# Altium schematic sheet BoardB-USB.SchDoc
size A; SheetNumber: 6; SheetTotal: 9
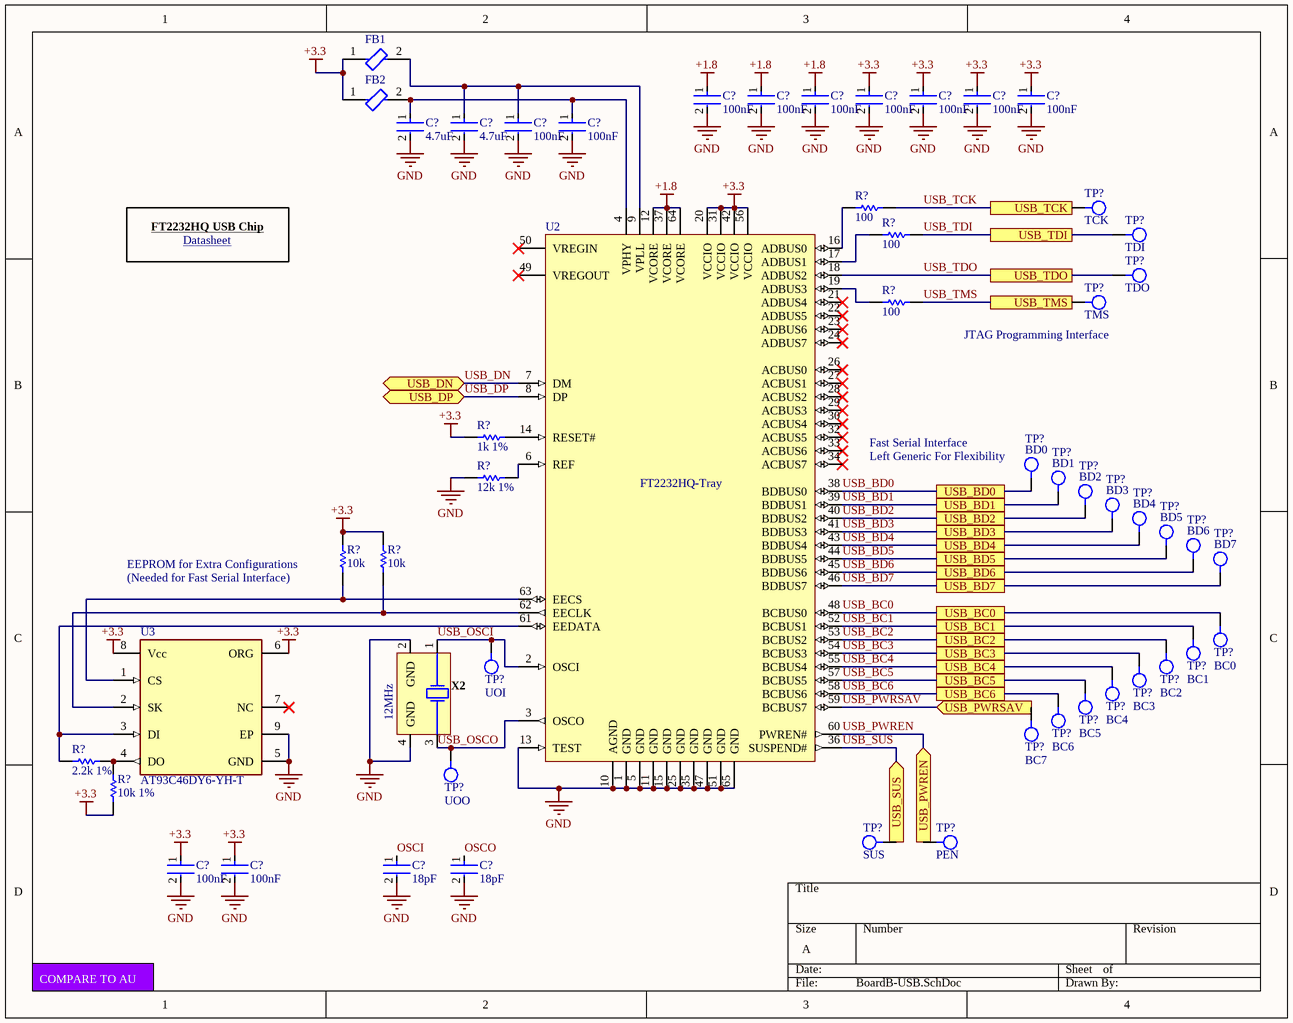
[diagram p0: BoardB-USB.SchDoc]

## Parts
(Parts that share a designator on the sheet are numbered #1, #2 ... from top to bottom, then left to right.)
C?#1  100nF  [FP-C0402-BB-MFG]
C?#2  100nF  [FP-C0402-BB-MFG]
C?#3  100nF  [FP-C0402-BB-MFG]
C?#4  100nF  [FP-C0402-BB-MFG]
C?#5  100nF  [FP-C0402-BB-MFG]
C?#6  100nF  [FP-C0402-BB-MFG]
C?#7  100nF  [FP-C0402-BB-MFG]
C?#8  4.7uF  [FP-GRM155-0_1-IPC_B]
C?#9  4.7uF  [FP-GRM155-0_1-IPC_B]
C?#10  100nF  [FP-C0402-BB-MFG]
C?#11  100nF  [FP-C0402-BB-MFG]
C?#12  100nF  [FP-C0402-BB-MFG]
C?#13  100nF  [FP-C0402-BB-MFG]
C?#14  18pF  [FP-C0402-BB-MFG]
C?#15  18pF  [FP-C0402-BB-MFG]
FB1  MI0603J601R-10  [FP-MI0603-MFG]  (value not drawn)
FB2  MI0603J601R-10  [FP-MI0603-MFG]  (value not drawn)
R?#1  100  [RESC1005X40X25ML05T10]
R?#2  100  [RESC1005X40X25ML05T10]
R?#3  100  [RESC1005X40X25ML05T10]
R?#4  1k 1%  [RESC1005X40X25NL05T10]
R?#5  12k 1%  [RESC1005X40X25ML05T05]
R?#6  10k  [RESC1005X40X25LL05T05]
R?#7  10k  [RESC1005X40X25LL05T05]
R?#8  2.2k 1%  [RESC1005X40X25NL05T10]
R?#9  10k 1%  [RESC1005X40X25LL05T05]
TP?#1  TCK
TP?#2  TDI
TP?#3  TDO
TP?#4  TMS
TP?#5  BD0
TP?#6  BD1
TP?#7  BD2
TP?#8  BD3
TP?#9  BD4
TP?#10  BD5
TP?#11  BD6
TP?#12  BD7
TP?#13  BC0
TP?#14  BC1
TP?#15  UOI
TP?#16  BC2
TP?#17  BC3
TP?#18  BC4
TP?#19  BC5
TP?#20  BC6
TP?#21  BC7
TP?#22  UOO
TP?#23  SUS
TP?#24  PEN
U2  FT2232HQ-Tray  [QFN64_2_N]
U3  AT93C46DY6-YH-T  [FP-C04-21355-Q4B-IPC_C]
X2  ABM8G-12.000MHZ-4Y-T3  [ABM8G-12.000MHZ-4Y-T3]  (value not drawn)

## Ports
USB_BC0, USB_BC1, USB_BC2, USB_BC3, USB_BC4, USB_BC5, USB_BC6, USB_BD0, USB_BD1, USB_BD2, USB_BD3, USB_BD4, USB_BD5, USB_BD6, USB_BD7, USB_DN (bidir), USB_DP (bidir), USB_PWREN (in), USB_PWRSAV (in), USB_SUS (in), USB_TCK, USB_TDI, USB_TDO, USB_TMS

## Nets
+1.8: C?#1.1 C?#2.1 C?#3.1 U2.12(VCORE) U2.37(VCORE) U2.64(VCORE)
+3.3: C?#4.1 C?#5.1 C?#6.1 C?#7.1 C?#12.1 C?#13.1 FB1.1 FB2.1 R?#4.1 R?#6.2 R?#7.2 R?#9.1 U2.20(VCCIO) U2.31(VCCIO) U2.42(VCCIO) U2.56(VCCIO) U3.6(ORG) U3.8(Vcc)
GND: C?#1.2 C?#2.2 C?#3.2 C?#4.2 C?#5.2 C?#6.2 C?#7.2 C?#8.2 C?#9.2 C?#10.2 C?#11.2 C?#12.2 C?#13.2 C?#14.2 C?#15.2 R?#5.1 U2.1(GND) U2.5(GND) U2.10(AGND) U2.11(GND) U2.13(TEST) U2.15(GND) U2.25(GND) U2.35(GND) U2.47(GND) U2.51(GND) U2.65(GND) U3.5(GND) U3.9(EP) X2.2(GND) X2.4(GND)
OSCI: C?#14.1
OSCO: C?#15.1
USB_BC0: TP?#13.1 U2.48(BCBUS0) ; port USB_BC0
USB_BC1: TP?#14.1 U2.52(BCBUS1) ; port USB_BC1
USB_BC2: TP?#16.1 U2.53(BCBUS2) ; port USB_BC2
USB_BC3: TP?#17.1 U2.54(BCBUS3) ; port USB_BC3
USB_BC4: TP?#18.1 U2.55(BCBUS4) ; port USB_BC4
USB_BC5: TP?#19.1 U2.57(BCBUS5) ; port USB_BC5
USB_BC6: TP?#20.1 U2.58(BCBUS6) ; port USB_BC6
USB_BD0: TP?#5.1 U2.38(BDBUS0) ; port USB_BD0
USB_BD1: TP?#6.1 U2.39(BDBUS1) ; port USB_BD1
USB_BD2: TP?#7.1 U2.40(BDBUS2) ; port USB_BD2
USB_BD3: TP?#8.1 U2.41(BDBUS3) ; port USB_BD3
USB_BD4: TP?#9.1 U2.43(BDBUS4) ; port USB_BD4
USB_BD5: TP?#10.1 U2.44(BDBUS5) ; port USB_BD5
USB_BD6: TP?#11.1 U2.45(BDBUS6) ; port USB_BD6
USB_BD7: TP?#12.1 U2.46(BDBUS7) ; port USB_BD7
USB_DN: U2.7(DM) ; port USB_DN
USB_DP: U2.8(DP) ; port USB_DP
USB_OSCI: TP?#15.1 U2.2(OSCI) X2.1
USB_OSCO: TP?#22.1 U2.3(OSCO) X2.3
USB_PWREN: TP?#24.1 U2.60(PWREN#) ; port USB_PWREN
USB_PWRSAV: TP?#21.1 U2.59(BCBUS7) ; port USB_PWRSAV
USB_SUS: TP?#23.1 U2.36(SUSPEND#) ; port USB_SUS
USB_TCK: R?#1.2 TP?#1.1 ; port USB_TCK
USB_TDI: R?#2.2 TP?#2.1 ; port USB_TDI
USB_TDO: TP?#3.1 U2.18(ADBUS2) ; port USB_TDO
USB_TMS: R?#3.2 TP?#4.1 ; port USB_TMS
NetC?#8_1: C?#8.1 C?#11.1 FB2.2 U2.4(VPHY)
NetC?#9_1: C?#9.1 C?#10.1 FB1.2 U2.9(VPLL)
NetR?#1_1: R?#1.1 U2.16(ADBUS0)
NetR?#2_1: R?#2.1 U2.17(ADBUS1)
NetR?#3_1: R?#3.1 U2.19(ADBUS3)
NetR?#4_2: R?#4.2 U2.14(RESET#)
NetR?#5_2: R?#5.2 U2.6(REF)
NetR?#6_1: R?#6.1 U2.63(EECS) U3.1(CS)
NetR?#7_1: R?#7.1 U2.62(EECLK) U3.2(SK)
NetR?#8_1: R?#8.1 U2.61(EEDATA) U3.3(DI)
NetR?#8_2: R?#8.2 R?#9.2 U3.4(DO)

Not connected (* = marked no-connect by the designer): U2 21(ADBUS4)* 22(ADBUS5)* 23(ADBUS6)* 24(ADBUS7)* 26(ACBUS0)* 27(ACBUS1)* 28(ACBUS2)* 29(ACBUS3)* 30(ACBUS4)* 32(ACBUS5)* 33(ACBUS6)* 34(ACBUS7)* 49(VREGOUT)* 50(VREGIN)*; U3 7(NC)*

## Notes on the sheet
- FT2232HQ USB Chip
- Datasheet <https://www.ftdichip.com/Support/Documents/DataSheets/ICs/DS_FT2232H.pdf>
- (near TP?#4) JTAG Programming Interface
- Fast Serial Interface
- (near TP?#5) Left Generic For Flexibility
- (near R?#6) EEPROM for Extra Configurations
- (near R?#6) (Needed for Fast Serial Interface)
- (near X2) 12MHz
- COMPARE TO AU

## Library data of the parts
C?#1-C?#7 C?#10-C?#13 = CMP-2008-02046-2: CAP CER 0.1UF 10V X5R 0402; Manufacturer: Kemet; Manufacturer Part Number: C0402C104K8PACTU; Material: Ceramic; Capacitance: 0.10 μF; Temperature Coefficient: 15%; Tolerance: 0.1; Value: 0.10 μF; Package: C0402-BB; Temperature: -55°C to +125°C; ComponentLink2Description: Datasheet; Temperature Characteristic: X5R; Device Class L1: Passive Components; Height: 0.55mm; Lead Free: Yes; ComponentLink2URL: https://content.kemet.com/datasheets/KEM_C1002_X7R_SMD.pdf; Device Class L2: Capacitors; Temperature Range Low: -55°C; Temperature Range High: +125°C; RoHS: TRUE; Octopart: https://octopart.com/c0402c104k8pactu-kemet-140039; Automotive: No; Mouser Description: Capacitor 100 nF 10 VDC 0402; Category: Cap; Voltage Rating: 10 V; Digikey Description: CAP CER 0.1UF 10V X5R 0402; Ipc Land Pattern Name: CAPC10050X50; Device Class L3: Ceramic Capacitors
C?#8 C?#9 = CMP-2008-04549-2: Chip Multilayer Ceramic Capacitors for General Purpose, 0402, 4.7uF, X5R, 15%, 20%, 6.3V; Height: 0.5mm; Weight: 0.000212oz; Length: 1mm; Case Code (Metric): 1005; Packaging: Tape and Reel; Termination: SMD/SMT; Dielectric: X5R; Depth: 0.5mm; Case Code (Imperial): 0402; Min Operating Temperature: -55°C; Case/Package: 0402; Voltage: 6.3V; Width: 0.02inch; Capacitance: 4.7uF; Lead Free: Lead Free; Thickness: 0.022inch; Contact Plating: Tin; REACH SVHC: No SVHC; Package Quantity: 10000; Tolerance: 20%; Voltage Rating (DC): 6.3V; Voltage Rating: 6.3V; Mount: Surface Mount; Max Operating Temperature: 85°C
C?#14 C?#15 = CMP-2008-03288-2: CAP CER 18PF 50V 5% NP0 0402; Manufacturer Part Number: C0402C180J5GACTU; Manufacturer: Kemet; Temperature Coefficient: 15%; Temperature Characteristic: C0G; Tolerance: 0.05; Material: Ceramic; Ipc Land Pattern Name: CAPC10050X50; Capacitance: 18 pF; Category: Cap; RoHS: TRUE; Automotive: No; Temperature Range High: +125°C; Height: 0.55mm; ComponentLink2Description: Datasheet; Lead Free: Yes; Value: 18 pF; Device Class L3: Ceramic Capacitors; Device Class L1: Passive Components; Digikey Description: CAP CER 18PF 50V 5% NP0 0402; Device Class L2: Capacitors; Voltage Rating: 50 V; ComponentLink2URL: https://content.kemet.com/datasheets/KEM_C1002_X7R_SMD.pdf; Octopart: https://octopart.com/c0402c180j5gactu-kemet-9138803; Mouser Description: Multilayer Ceramic Capacitors MLCC - SMD/SMT 50volts 18pF C0G 5%; Temperature: -55°C to +125°C; Temperature Range Low: -55°C; Package: C0402-BB
FB1 FB2 = CMP-2000-06700-2: FERRITE BEAD 600 OHM 0603 1LN; Manufacturer: Laird; Rms Current: 1000mA; Series Resistance: 0.2Ω; Impedance At Frequency: 600Ω @ 100MHz; Package: MI0603; Device Class L2: EMI / RFI Components; Ipc Land Pattern Name: CAPC16080X80; Category: FBead; Digikey Description: FERRITE BEAD 600 OHM 0603 1LN; Temperature Range High: +125°C; Temperature: -40°C to +125°C; Height: 0.95mm; Manufacturer Part Number: MI0603J601R-10; ComponentLink2Description: Datasheet; Lead Free: Yes; Automotive: No; ComponentLink2URL: https://www.laird.com/sites/default/files/2019-04/MI0603J601R-10_0.pdf; Device Class L3: Ferrite Beads and Chips; Octopart: https://octopart.com/mi0603j601r-10-laird-19252844; Mouser Description: Emi Ferrite Chip Bead, 0603, 1000ma, 600 Ohms @100mhz, Dcr Max 0.20ohm; Temperature Range Low: -40°C; RoHS: TRUE; Device Class L1: Passive Components
R?#1-R?#3 = CMP-2002-07344-1: Part Number: RC0402FR-07100RL; Manufacturer: Yageo / Phycomp
R?#4 = CMP-2002-07472-1: Part Number: RC0402FR-071KL; Manufacturer: Yageo / Phycomp
R?#5 = CMP-2002-00646-4: Chip Resistor, 12 KOhm, +/- 1%, 0.1 W, -55 to 155 degC, 0402 (1005 Metric), RoHS, Tape and Reel; PartNumber: ERJ-2RKF1202X; Resistance: 12 KOhm; Voltage Rating: 50 V; Case\/Package: 0402; Power Rating: 100 mW; Length: 1 mm; PackageReference: 0402; DatasheetVersion: 04/2015; ComponentLink2Description: Datasheet; ComponentLink1URL: http://www.panasonic.com/; Pins: 2; Width: 0.5 mm; REACH SVHC: Yes; Packaging: Tape and Reel; Min Operating Temperature: -55 degC; Mounting Technology: Surface Mount; Max Operating Temperature: 155 degC; Case Code (Imperial): 0402; Height: 0.35 mm; Tolerance: 1%; PackageDescription: 2-Pin Surface Mount Device, Body 1 x 0.5 mm; RoHSCompliant: true; ComponentLink1Description: Manufacturer URL; Mount: Surface Mount; ComponentLink2URL: http://industrial.panasonic.com/cdbs/www-data/pdf/RDA0000/AOA0000C86.pdf; Package Quantity: 10000; Case Code (Metric): 1005
R?#6 R?#7 R?#9 = CMP-2000-07588-1: Chip Resistor, 10 KOhm, +/- 1%, 0.1 W, -55 to 155 degC, 0402 (1005 Metric), RoHS, Tape and Reel; Manufacturer: Panasonic; Power Rating: 100mW; Voltage Rating: 50V; Resistance: 10KOhm; Case\/Package: 0402; Temperature Coefficient: 100ppm\/degreesC; RoHSCompliant: True; Lead Free: LeadFree; Package Quantity: 1; Contact Plating: Tin; Length: 1mm; Radiation Hardening: No; REACH SVHC: NoSVHC; Max Operating Temperature: 155degC; Depth: 0.5mm; Case Code (Imperial): 0402; Military Standard: Not; Package Description: 2-Pin Surface Mount Device, Body 1 x 0.5 mm; Termination: SMD/SMT; Case Code (Metric): 1005; Height: 0.35mm; Packaging: TapeandReel; Voltage Rating (DC): 50V; Package Reference: 402; Number of Pins: 2; Tolerance: 1%; Mounting Technology: SurfaceMount; Width: 0.02inch; Mount: SurfaceMount; Datasheet URL: https://industrial.panasonic.com/cdbs/www-data/pdf/RDA0000/AOA0000C304.pdf; Composition: ThickFilm; Datasheet Version: 02/2017; Manufacturer URL: http://www.panasonic.com/; Max Power Dissipation: 100mW; Number of Terminations: 2; Min Operating Temperature: -55degC
R?#8 = CMP-2002-07567-1: Manufacturer: Yageo / Phycomp; Part Number: RC0402FR-072K2L
TP?#1-TP?#24 = TestPoint1mm
U2 = CMP-0078-00003-3: Dual High Speed USB To Multipurpose UART/FIFO IC, 64-pin QFN, Tray; Manufacturer: FTDI; PackageVersion: Jun-12; ComponentLink2URL: http://www.ftdichip.com/Support/Documents/DataSheets/ICs/DS_FT2232H.pdf; ComponentLink1Description: Manufacturer URL; RevisionNote: DatasheetVersion updated to 2.21 Jun-2012; PackageReference: QFN64_2; PackageDescription: 64-Pin Quad Flat No-Lead, 9 x 9 mm Body, 0.5 mm Pitch, 4.35 x 4.35 mm Exposed Pad; ComponentLink2Description: Datasheet; ComponentLink1URL: http://www.ftdichip.com/; PartNumber: FT2232HQ-Tray; DatasheetVersion: ver 2.21, Jun-2012
U3 = CMP-06313-000080-1: IC EEPROM 1KBIT SPI 8MINI MAP; Frequency: 2MHz; Memory Type: Non-Volatile; Memory Size: 1Kb; Max Operating Temperature: 85°C; RoHS Compliant: Yes; Packaging: Tape and Reel; Min Operating Temperature: -40°C; Mount: Surface Mount
X2 = ABM8G-12.000MHZ-4Y-T3: ABRACON - ABM8G-12.000MHZ-4Y-T3 - CRYSTAL, 12MHZ, 10PF, 3.2 X 2.5MM; ESR (Equivalent Series Resistance): 120R; Frequency Tolerance: 30ppm; Supplier 1: Digi-Key; RoHS: Yes; Stock 1: 11481; Pricing 1: 1=0.67000, 10=0.59600, 50=0.55720, 100=0.49250, 500=0.46656, 1000=0.38880 (USD); Mount: Surface Mount; Case/Package: CSMD; Number of Pins: 4; Min Operating Temperature: -10°C; Max Operating Temperature: 60°C; Frequency: 12MHz; Load Capacitance: 10pF; Packaging: Tape and Reel; Frequency Stability: 30ppm; Series: ABM8G; Series Resistance: 120R; Operating Frequency: 12 MHz; Length: 3.2mm; Width: 0.098inch; Height: 0.039inch; Depth: 2.5mm; REACH SVHC: No SVHC; Lead Free: Lead Free; ComponentLink1URL: https://datasheet.ciiva.com/15116/getdatasheetpartid-719872-15116768.pdf?src-supplier=Verical; ComponentLink1Description: https://datasheet.ciiva.com/15116/getdatasheetpartid-719872-15116768.pdf?src-supplier=Verical; ComponentLink2URL: https://datasheet.ciiva.com/857/abm8g-857959.pdf?src-supplier=Digi-Key; ComponentLink2Description: https://datasheet.ciiva.com/857/abm8g-857959.pdf?src-supplier=Digi-Key; ComponentLink3URL: https://datasheet.ciiva.com/857/abm8g-857960.pdf?src-supplier=Digi-Key; ComponentLink3Description: https://datasheet.ciiva.com/857/abm8g-857960.pdf?src-supplier=Digi-Key; ComponentLink4URL: https://datasheet.ciiva.com/857/abm8g-857961.pdf?src-supplier=Digi-Key; ComponentLink4Description: https://datasheet.ciiva.com/857/abm8g-857961.pdf?src-supplier=Digi-Key; ComponentLink5URL: https://datasheet.ciiva.com/16216/abm8g-16216655.pdf?src-supplier=Future+Electronics; ComponentLink5Description: https://datasheet.ciiva.com/16216/abm8g-16216655.pdf?src-supplier=Future+Electronics; Manufacturer Part Number: ABM8G-12.000MHZ-4Y-T3; Manufacturer: Abracon; Supplier Part Number 1: 535-10901-1-ND; Category: Crystals